# EAGLE schematic igreplane (EAGLE 5.06)
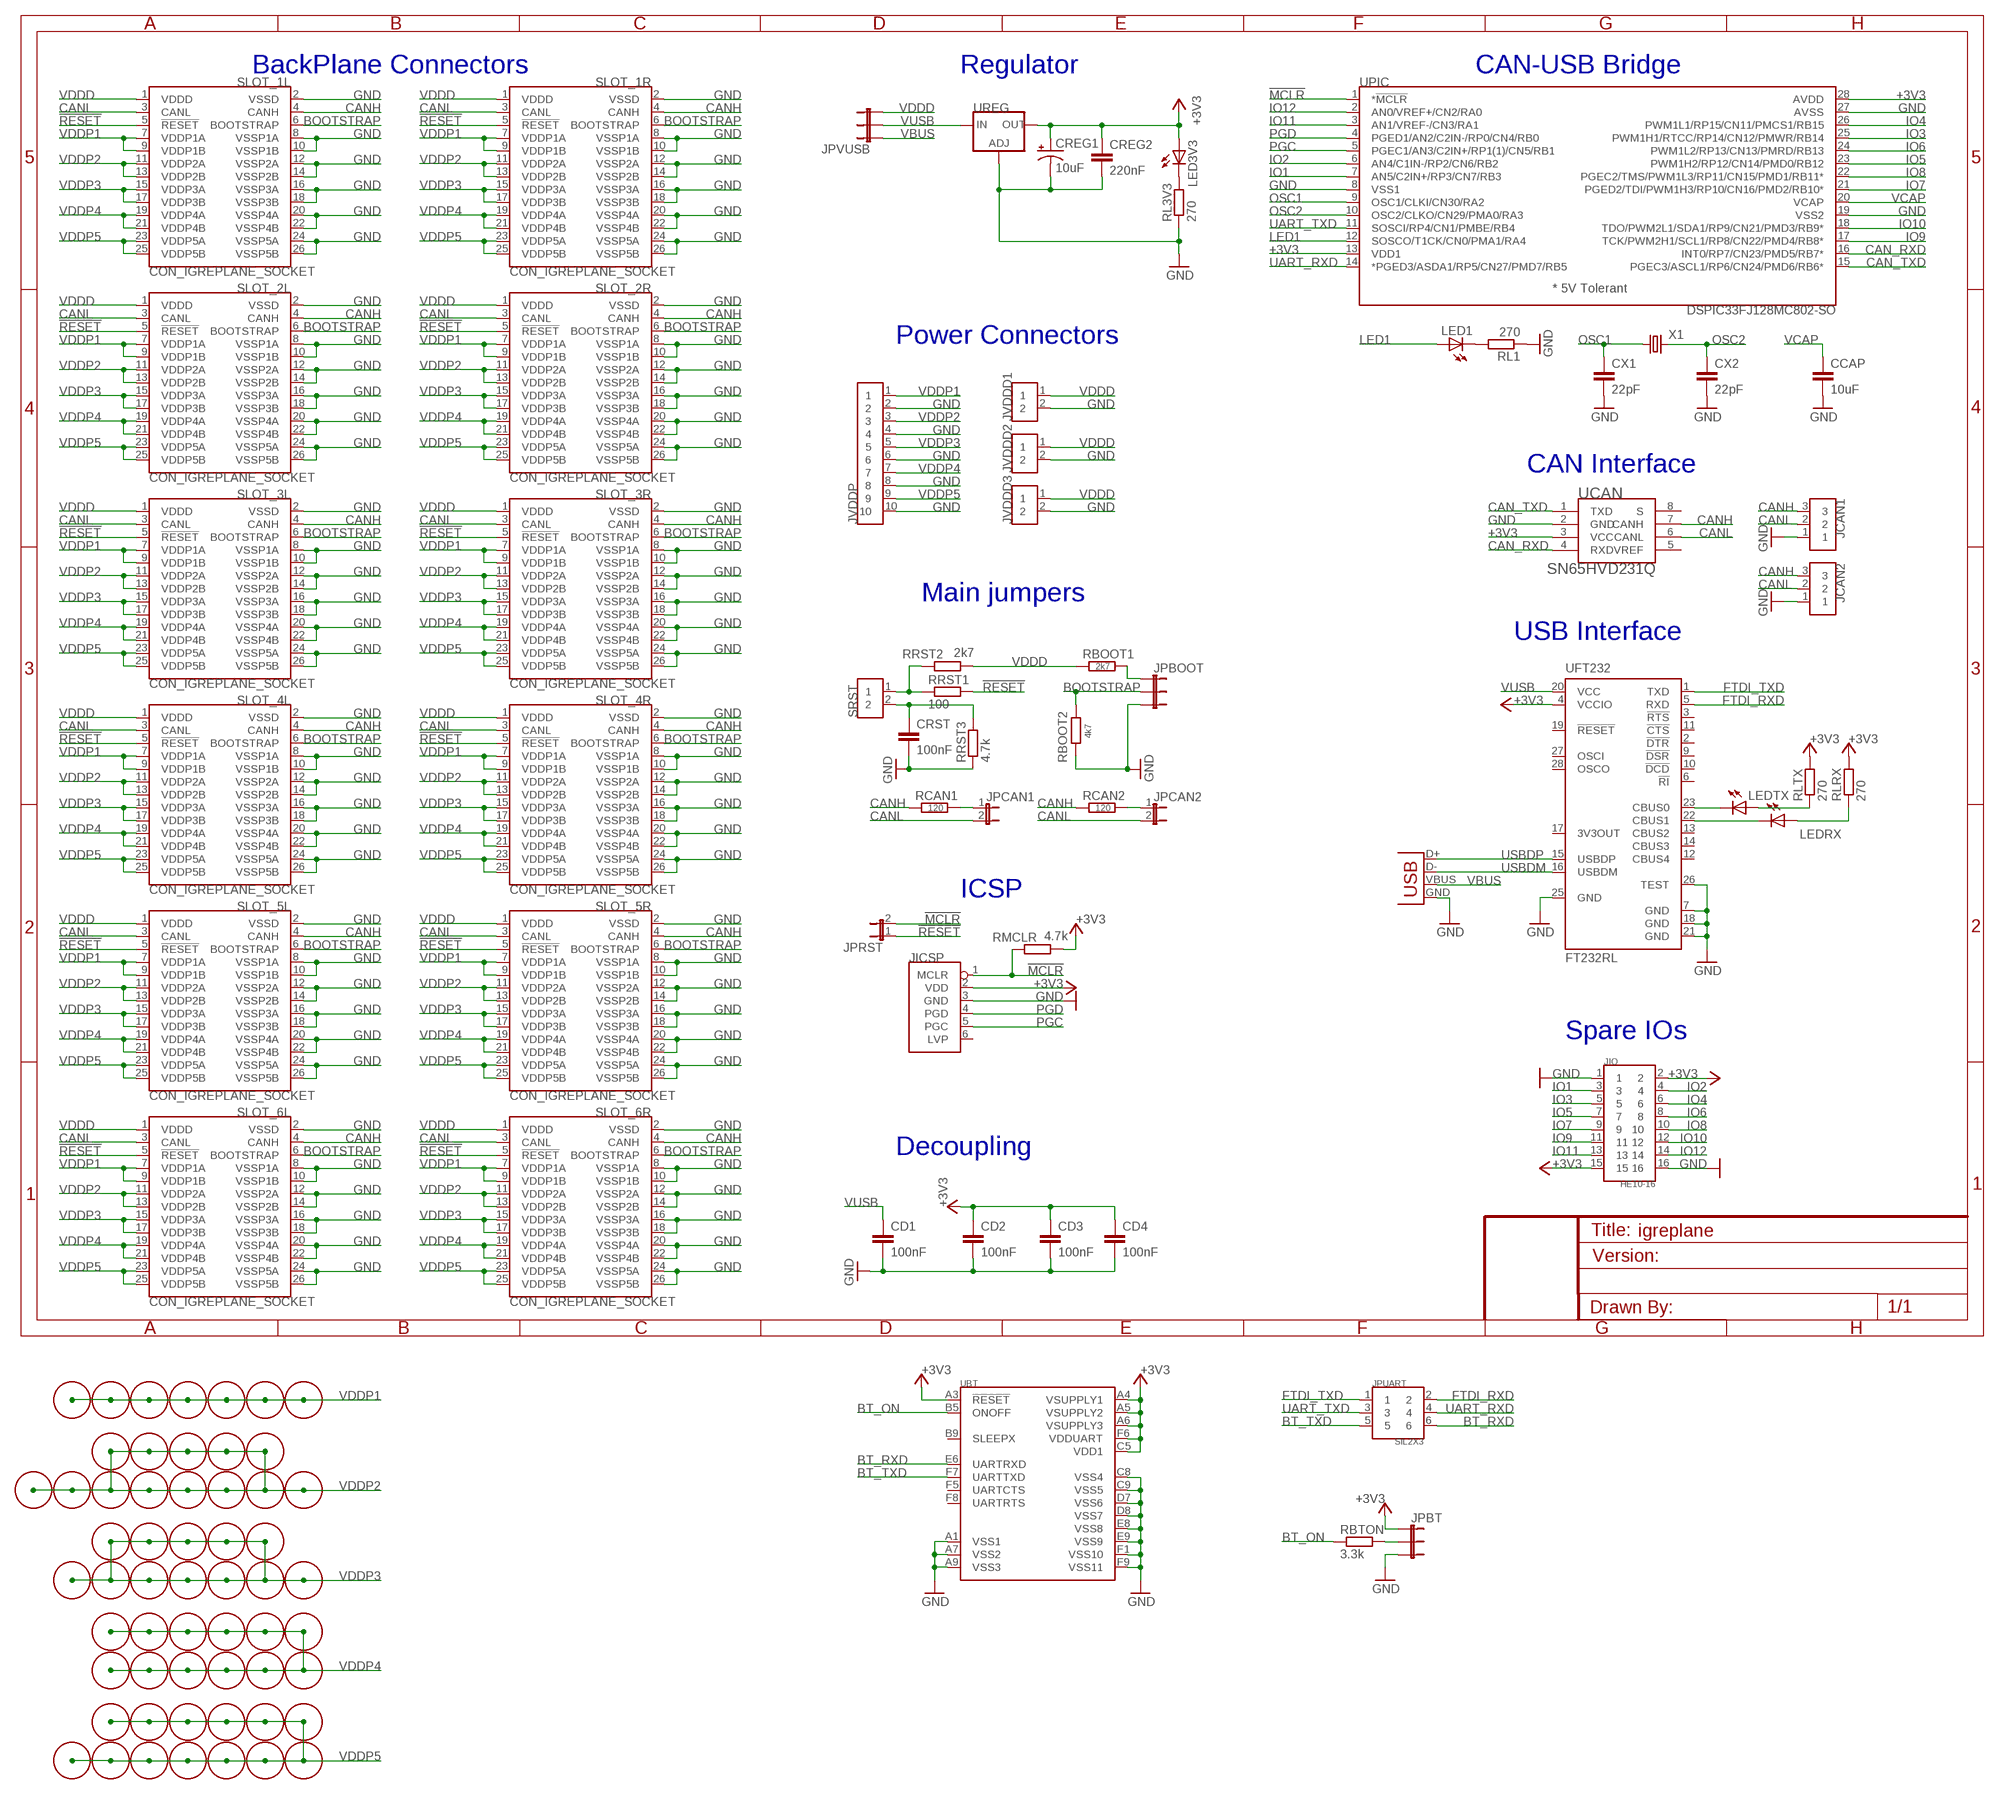
[diagram p0: schematic, sheet 1, part 1 of 2]
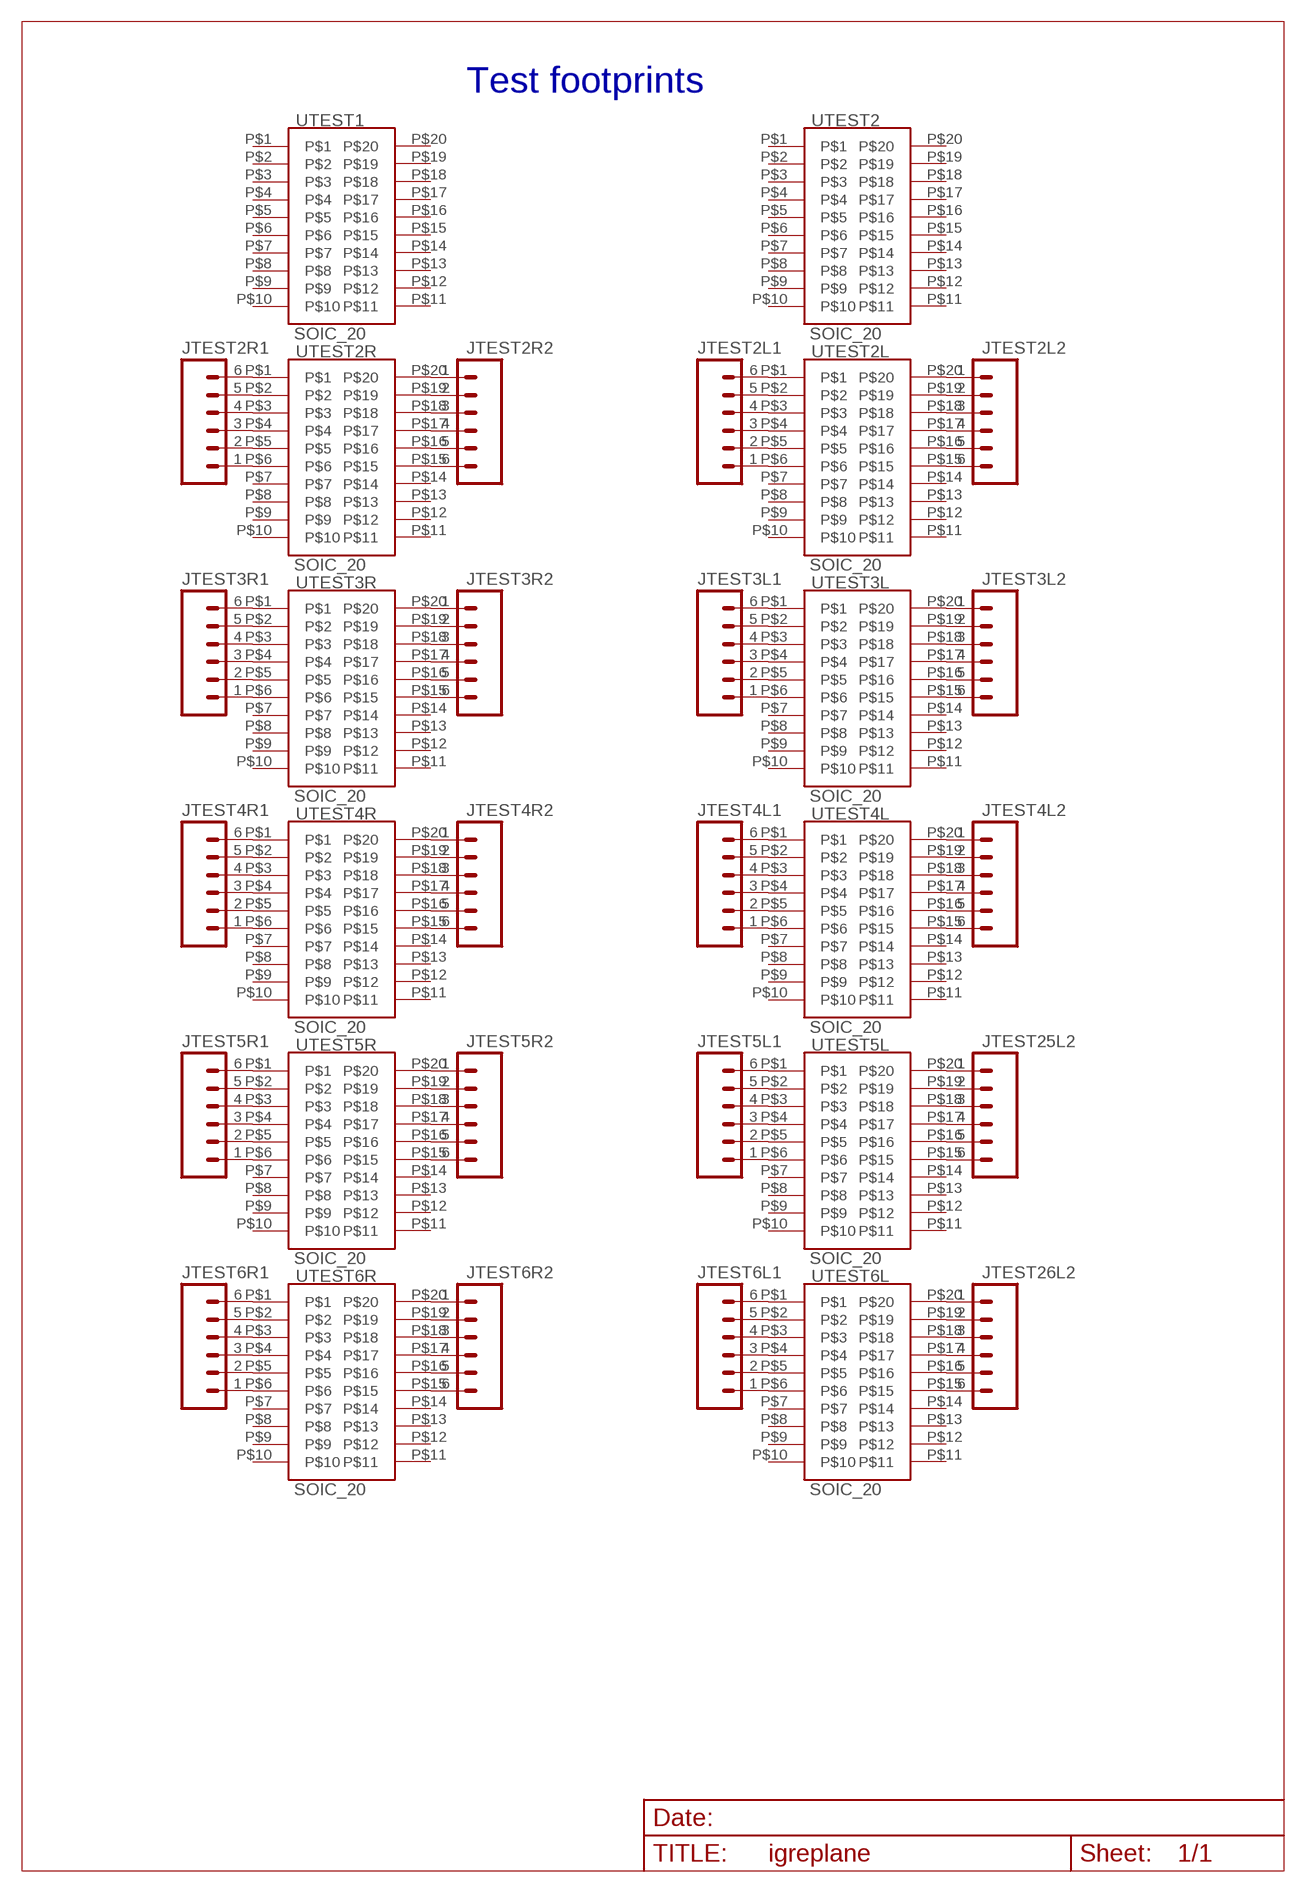
[diagram p1: schematic, sheet 1, part 2 of 2]

## Parts
CCAP  10uF  C-EUC1206  [C1206]
CD1  100nF  C-EUC0603  [C0603]
CD2  100nF  C-EUC0603  [C0603]
CD3  100nF  C-EUC0603  [C0603]
CD4  100nF  C-EUC0603  [C0603]
CREG1  10uF  CAP_POL1206  [EIA3216]
CREG2  220nF  C-EUC0603  [C0603]
CRST  100nF  C-EUC1206  [C1206]
CX1  22pF  C-EUC0603  [C0603]
CX2  22pF  C-EUC0603  [C0603]
JCAN1  SIL3  [CON3-2.54]
JCAN2  SIL3  [CON3-2.54]
JICSP  PICKIT_H  [PICKIT_H]
JIO  HE10-16  [CON-HE10-16-2.54]
JPBOOT  JUMPER-3PTH  [1X03]
JPBT  JUMPER-3PTH  [1X03]
JPCAN1  JUMPER-2PTH_LOCK  [1X02_LOCK]
JPCAN2  JUMPER-2PTH_LOCK  [1X02_LOCK]
JPRST  JUMPER-2PTH_LOCK  [1X02_LOCK]
JPUART  SIL2X3  [CON2X3-2.54]
JPVUSB  JUMPER-3PTH  [1X03]
JTEST2L1  M06SMD-STRAIGHT-ALT  [1X06_SMD_STRAIGHT_ALT]
JTEST2L2  M06SMD-STRAIGHT-ALT  [1X06_SMD_STRAIGHT_ALT]
JTEST2R1  M06SMD-STRAIGHT-ALT  [1X06_SMD_STRAIGHT_ALT]
JTEST2R2  M06SMD-STRAIGHT-ALT  [1X06_SMD_STRAIGHT_ALT]
JTEST3L1  M06SMD-STRAIGHT-ALT  [1X06_SMD_STRAIGHT_ALT]
JTEST3L2  M06SMD-STRAIGHT-ALT  [1X06_SMD_STRAIGHT_ALT]
JTEST3R1  M06SMD-STRAIGHT-ALT  [1X06_SMD_STRAIGHT_ALT]
JTEST3R2  M06SMD-STRAIGHT-ALT  [1X06_SMD_STRAIGHT_ALT]
JTEST4L1  M06SMD-STRAIGHT-ALT  [1X06_SMD_STRAIGHT_ALT]
JTEST4L2  M06SMD-STRAIGHT-ALT  [1X06_SMD_STRAIGHT_ALT]
JTEST4R1  M06SMD-STRAIGHT-ALT  [1X06_SMD_STRAIGHT_ALT]
JTEST4R2  M06SMD-STRAIGHT-ALT  [1X06_SMD_STRAIGHT_ALT]
JTEST5L1  M06SMD-STRAIGHT-ALT  [1X06_SMD_STRAIGHT_ALT]
JTEST5R1  M06SMD-STRAIGHT-ALT  [1X06_SMD_STRAIGHT_ALT]
JTEST5R2  M06SMD-STRAIGHT-ALT  [1X06_SMD_STRAIGHT_ALT]
JTEST6L1  M06SMD-STRAIGHT-ALT  [1X06_SMD_STRAIGHT_ALT]
JTEST6R1  M06SMD-STRAIGHT-ALT  [1X06_SMD_STRAIGHT_ALT]
JTEST6R2  M06SMD-STRAIGHT-ALT  [1X06_SMD_STRAIGHT_ALT]
JTEST25L2  M06SMD-STRAIGHT-ALT  [1X06_SMD_STRAIGHT_ALT]
JTEST26L2  M06SMD-STRAIGHT-ALT  [1X06_SMD_STRAIGHT_ALT]
JUSB  USBSMD  [USB-MINIB]
JVDDD1  SIL2  [CON2-2.54]
JVDDD2  SIL2  [CON2-2.54]
JVDDD3  SIL2  [CON2-2.54]
JVDDP  MULTICOMP_PA001-10  [CON10-5.00]
LED1  LEDCHIPLED_0603  [CHIPLED_0603]
LED3V3  LEDCHIPLED_0603  [CHIPLED_0603]
LEDRX  LEDCHIPLED_0603  [CHIPLED_0603]
LEDTX  LEDCHIPLED_0603  [CHIPLED_0603]
RBOOT1  2k7  R-EU_R0603  [R0603]
RBOOT2  4k7  R-EU_R0603  [R0603]
RBTON  3.3k  R-EU_R0603  [R0603]
RCAN1  120  R-EU_R0603  [R0603]
RCAN2  120  R-EU_R0603  [R0603]
RL1  270  R-EU_R0603  [R0603]
RL3V3  270  R-EU_R0603  [R0603]
RLRX  270  R-EU_R0603  [R0603]
RLTX  270  R-EU_R0603  [R0603]
RMCLR  4.7k  R-EU_R0603  [R0603]
RRST1  100  R-EU_R0603  [R0603]
RRST2  2k7  R-EU_R0603  [R0603]
RRST3  4.7k  R-EU_R0603  [R0603]
SLOT_1L  CON_IGREPLANE_SOCKET  [CON_WURTH_6130_26_216921]
SLOT_1R  CON_IGREPLANE_SOCKET  [CON_WURTH_6130_26_216921]
SLOT_2L  CON_IGREPLANE_SOCKET  [CON_WURTH_6130_26_216921]
SLOT_2R  CON_IGREPLANE_SOCKET  [CON_WURTH_6130_26_216921]
SLOT_3L  CON_IGREPLANE_SOCKET  [CON_WURTH_6130_26_216921]
SLOT_3R  CON_IGREPLANE_SOCKET  [CON_WURTH_6130_26_216921]
SLOT_4L  CON_IGREPLANE_SOCKET  [CON_WURTH_6130_26_216921]
SLOT_4R  CON_IGREPLANE_SOCKET  [CON_WURTH_6130_26_216921]
SLOT_5L  CON_IGREPLANE_SOCKET  [CON_WURTH_6130_26_216921]
SLOT_5R  CON_IGREPLANE_SOCKET  [CON_WURTH_6130_26_216921]
SLOT_6L  CON_IGREPLANE_SOCKET  [CON_WURTH_6130_26_216921]
SLOT_6R  CON_IGREPLANE_SOCKET  [CON_WURTH_6130_26_216921]
SRST  SIL2  [CON2-2.54]
U$1  VIA-5_0.3  [VIA-5_0.3]
U$2  VIA-5_0.3  [VIA-5_0.3]
U$3  VIA-5_0.3  [VIA-5_0.3]
U$4  VIA-5_0.3  [VIA-5_0.3]
U$5  VIA-5_0.3  [VIA-5_0.3]
U$6  VIA-5_0.3  [VIA-5_0.3]
U$7  VIA-5_0.3  [VIA-5_0.3]
U$8  VIA-5_0.3  [VIA-5_0.3]
U$9  VIA-5_0.3  [VIA-5_0.3]
U$10  VIA-5_0.3  [VIA-5_0.3]
U$11  VIA-5_0.3  [VIA-5_0.3]
U$12  VIA-5_0.3  [VIA-5_0.3]
U$13  VIA-5_0.3  [VIA-5_0.3]
U$14  VIA-5_0.3  [VIA-5_0.3]
U$15  VIA-5_0.3  [VIA-5_0.3]
U$16  VIA-5_0.3  [VIA-5_0.3]
U$17  VIA-5_0.3  [VIA-5_0.3]
U$18  VIA-5_0.3  [VIA-5_0.3]
U$19  VIA-5_0.3  [VIA-5_0.3]
U$20  VIA-5_0.3  [VIA-5_0.3]
U$21  VIA-5_0.3  [VIA-5_0.3]
U$22  VIA-5_0.3  [VIA-5_0.3]
U$23  VIA-5_0.3  [VIA-5_0.3]
U$24  VIA-5_0.3  [VIA-5_0.3]
U$25  VIA-5_0.3  [VIA-5_0.3]
U$26  VIA-5_0.3  [VIA-5_0.3]
U$27  VIA-5_0.3  [VIA-5_0.3]
U$28  VIA-5_0.3  [VIA-5_0.3]
U$29  VIA-5_0.3  [VIA-5_0.3]
U$30  VIA-5_0.3  [VIA-5_0.3]
U$31  VIA-5_0.3  [VIA-5_0.3]
U$32  VIA-5_0.3  [VIA-5_0.3]
U$33  VIA-5_0.3  [VIA-5_0.3]
U$34  VIA-5_0.3  [VIA-5_0.3]
U$35  VIA-5_0.3  [VIA-5_0.3]
U$37  VIA-5_0.3  [VIA-5_0.3]
U$38  VIA-5_0.3  [VIA-5_0.3]
U$39  VIA-5_0.3  [VIA-5_0.3]
U$40  VIA-5_0.3  [VIA-5_0.3]
U$41  VIA-5_0.3  [VIA-5_0.3]
U$42  VIA-5_0.3  [VIA-5_0.3]
U$43  VIA-5_0.3  [VIA-5_0.3]
U$44  VIA-5_0.3  [VIA-5_0.3]
U$45  VIA-5_0.3  [VIA-5_0.3]
U$46  VIA-5_0.3  [VIA-5_0.3]
U$47  VIA-5_0.3  [VIA-5_0.3]
U$48  VIA-5_0.3  [VIA-5_0.3]
U$49  VIA-5_0.3  [VIA-5_0.3]
U$50  VIA-5_0.3  [VIA-5_0.3]
U$51  VIA-5_0.3  [VIA-5_0.3]
U$52  VIA-5_0.3  [VIA-5_0.3]
U$53  VIA-5_0.3  [VIA-5_0.3]
U$54  VIA-5_0.3  [VIA-5_0.3]
U$55  VIA-5_0.3  [VIA-5_0.3]
U$56  VIA-5_0.3  [VIA-5_0.3]
U$57  VIA-5_0.3  [VIA-5_0.3]
U$58  VIA-5_0.3  [VIA-5_0.3]
UBT  PANASONIC_PAN1321-SPP  [BGA53_PAN1321-SSP]
UCAN  SN65HVD231Q  [SOIC8]
UFT232  FT232RL  [SSOP28]
UPIC  DSPIC33FJ128MC802-SO  [SOIC28]
UREG  V_REG_317SMD  [SOT223]
UTEST1  SOIC_20  [SO20W]
UTEST2  SOIC_20  [SO20W]
UTEST2L  SOIC_20  [SO20W]
UTEST2R  SOIC_20  [SO20W]
UTEST3L  SOIC_20  [SO20W]
UTEST3R  SOIC_20  [SO20W]
UTEST4L  SOIC_20  [SO20W]
UTEST4R  SOIC_20  [SO20W]
UTEST5L  SOIC_20  [SO20W]
UTEST5R  SOIC_20  [SO20W]
UTEST6L  SOIC_20  [SO20W]
UTEST6R  SOIC_20  [SO20W]
X1  CRYSTAL5X3  [CRYSTAL-SMD-5X3]

## Nets
!MCLR: JICSP.1(MCLR) JPRST.2 RMCLR.1 UPIC.1(*!MCLR!)
!RESET!: JPRST.1 RRST1.2 SLOT_1L.5(!RESET!) SLOT_1R.5(!RESET!) SLOT_2L.5(!RESET!) SLOT_2R.5(!RESET!) SLOT_3L.5(!RESET!) SLOT_3R.5(!RESET!) SLOT_4L.5(!RESET!) SLOT_4R.5(!RESET!) SLOT_5L.5(!RESET!) SLOT_5R.5(!RESET!) SLOT_6L.5(!RESET!) SLOT_6R.5(!RESET!)
+3V3 [POWER]: CD2.1 CD3.1 CD4.1 CREG1.A(+) CREG2.1 JICSP.2(VDD) JIO.2 JIO.15 JPBT.1 LED3V3.A RLRX.2 RLTX.2 RMCLR.2 UBT.A3(!RESET!) UBT.A4(VSUPPLY1) UBT.A5(VSUPPLY2) UBT.A6(VSUPPLY3) UBT.C5(VDD1) UBT.F6(VDDUART) UCAN.3(VCC) UFT232.4(VCCIO) UPIC.13(VDD1) UPIC.28(AVDD) UREG.2(OUT)
BOOTSTRAP: JPBOOT.2 RBOOT2.2 SLOT_1L.6(BOOTSTRAP) SLOT_1R.6(BOOTSTRAP) SLOT_2L.6(BOOTSTRAP) SLOT_2R.6(BOOTSTRAP) SLOT_3L.6(BOOTSTRAP) SLOT_3R.6(BOOTSTRAP) SLOT_4L.6(BOOTSTRAP) SLOT_4R.6(BOOTSTRAP) SLOT_5L.6(BOOTSTRAP) SLOT_5R.6(BOOTSTRAP) SLOT_6L.6(BOOTSTRAP) SLOT_6R.6(BOOTSTRAP)
BT_ON: RBTON.1 UBT.B5(ONOFF)
BT_RXD: JPUART.6 UBT.E6(UARTRXD)
BT_TXD: JPUART.5 UBT.F7(UARTTXD)
CAN_RXD: UCAN.4(RXD) UPIC.16(INT0/RP7/CN23/PMD5/RB7*)
CAN_TXD: UCAN.1(TXD) UPIC.15(PGEC3/ASCL1/RP6/CN24/PMD6/RB6*)
CANH: JCAN1.3 JCAN2.3 RCAN1.1 RCAN2.1 SLOT_1L.4(CANH) SLOT_1R.4(CANH) SLOT_2L.4(CANH) SLOT_2R.4(CANH) SLOT_3L.4(CANH) SLOT_3R.4(CANH) SLOT_4L.4(CANH) SLOT_4R.4(CANH) SLOT_5L.4(CANH) SLOT_5R.4(CANH) SLOT_6L.4(CANH) SLOT_6R.4(CANH) UCAN.7(CANH)
CANL: JCAN1.2 JCAN2.2 JPCAN1.2 JPCAN2.2 SLOT_1L.3(CANL) SLOT_1R.3(CANL) SLOT_2L.3(CANL) SLOT_2R.3(CANL) SLOT_3L.3(CANL) SLOT_3R.3(CANL) SLOT_4L.3(CANL) SLOT_4R.3(CANL) SLOT_5L.3(CANL) SLOT_5R.3(CANL) SLOT_6L.3(CANL) SLOT_6R.3(CANL) UCAN.6(CANL)
FTDI_RXD: JPUART.2 UFT232.5(RXD)
FTDI_TXD: JPUART.1 UFT232.1(TXD)
GND: CCAP.2 CD1.2 CD2.2 CD3.2 CD4.2 CREG1.C(-) CREG2.2 CRST.2 CX1.2 CX2.2 JCAN1.1 JCAN2.1 JICSP.3(GND) JIO.1 JIO.16 JPBOOT.3 JPBT.3 JUSB.GND JVDDD1.2 JVDDD2.2 JVDDD3.2 JVDDP.2 JVDDP.4 JVDDP.6 JVDDP.8 JVDDP.10 RBOOT2.1 RL1.1 RL3V3.1 RRST3.1 SLOT_1L.2(VSSD) SLOT_1L.8(VSSP1A) SLOT_1L.10(VSSP1B) SLOT_1L.12(VSSP2A) SLOT_1L.14(VSSP2B) SLOT_1L.16(VSSP3A) SLOT_1L.18(VSSP3B) SLOT_1L.20(VSSP4A) SLOT_1L.22(VSSP4B) SLOT_1L.24(VSSP5A) SLOT_1L.26(VSSP5B) SLOT_1R.2(VSSD) SLOT_1R.8(VSSP1A) SLOT_1R.10(VSSP1B) SLOT_1R.12(VSSP2A) SLOT_1R.14(VSSP2B) SLOT_1R.16(VSSP3A) SLOT_1R.18(VSSP3B) SLOT_1R.20(VSSP4A) SLOT_1R.22(VSSP4B) SLOT_1R.24(VSSP5A) SLOT_1R.26(VSSP5B) SLOT_2L.2(VSSD) SLOT_2L.8(VSSP1A) SLOT_2L.10(VSSP1B) SLOT_2L.12(VSSP2A) SLOT_2L.14(VSSP2B) SLOT_2L.16(VSSP3A) SLOT_2L.18(VSSP3B) SLOT_2L.20(VSSP4A) SLOT_2L.22(VSSP4B) SLOT_2L.24(VSSP5A) SLOT_2L.26(VSSP5B) SLOT_2R.2(VSSD) SLOT_2R.8(VSSP1A) SLOT_2R.10(VSSP1B) SLOT_2R.12(VSSP2A) SLOT_2R.14(VSSP2B) SLOT_2R.16(VSSP3A) SLOT_2R.18(VSSP3B) SLOT_2R.20(VSSP4A) SLOT_2R.22(VSSP4B) SLOT_2R.24(VSSP5A) SLOT_2R.26(VSSP5B) SLOT_3L.2(VSSD) SLOT_3L.8(VSSP1A) SLOT_3L.10(VSSP1B) SLOT_3L.12(VSSP2A) SLOT_3L.14(VSSP2B) SLOT_3L.16(VSSP3A) SLOT_3L.18(VSSP3B) SLOT_3L.20(VSSP4A) SLOT_3L.22(VSSP4B) SLOT_3L.24(VSSP5A) SLOT_3L.26(VSSP5B) SLOT_3R.2(VSSD) SLOT_3R.8(VSSP1A) SLOT_3R.10(VSSP1B) SLOT_3R.12(VSSP2A) SLOT_3R.14(VSSP2B) SLOT_3R.16(VSSP3A) SLOT_3R.18(VSSP3B) SLOT_3R.20(VSSP4A) SLOT_3R.22(VSSP4B) SLOT_3R.24(VSSP5A) SLOT_3R.26(VSSP5B) SLOT_4L.2(VSSD) SLOT_4L.8(VSSP1A) SLOT_4L.10(VSSP1B) SLOT_4L.12(VSSP2A) SLOT_4L.14(VSSP2B) SLOT_4L.16(VSSP3A) SLOT_4L.18(VSSP3B) SLOT_4L.20(VSSP4A) SLOT_4L.22(VSSP4B) SLOT_4L.24(VSSP5A) SLOT_4L.26(VSSP5B) SLOT_4R.2(VSSD) SLOT_4R.8(VSSP1A) SLOT_4R.10(VSSP1B) SLOT_4R.12(VSSP2A) SLOT_4R.14(VSSP2B) SLOT_4R.16(VSSP3A) SLOT_4R.18(VSSP3B) SLOT_4R.20(VSSP4A) SLOT_4R.22(VSSP4B) SLOT_4R.24(VSSP5A) SLOT_4R.26(VSSP5B) SLOT_5L.2(VSSD) SLOT_5L.8(VSSP1A) SLOT_5L.10(VSSP1B) SLOT_5L.12(VSSP2A) SLOT_5L.14(VSSP2B) SLOT_5L.16(VSSP3A) SLOT_5L.18(VSSP3B) SLOT_5L.20(VSSP4A) SLOT_5L.22(VSSP4B) SLOT_5L.24(VSSP5A) SLOT_5L.26(VSSP5B) SLOT_5R.2(VSSD) SLOT_5R.8(VSSP1A) SLOT_5R.10(VSSP1B) SLOT_5R.12(VSSP2A) SLOT_5R.14(VSSP2B) SLOT_5R.16(VSSP3A) SLOT_5R.18(VSSP3B) SLOT_5R.20(VSSP4A) SLOT_5R.22(VSSP4B) SLOT_5R.24(VSSP5A) SLOT_5R.26(VSSP5B) SLOT_6L.2(VSSD) SLOT_6L.8(VSSP1A) SLOT_6L.10(VSSP1B) SLOT_6L.12(VSSP2A) SLOT_6L.14(VSSP2B) SLOT_6L.16(VSSP3A) SLOT_6L.18(VSSP3B) SLOT_6L.20(VSSP4A) SLOT_6L.22(VSSP4B) SLOT_6L.24(VSSP5A) SLOT_6L.26(VSSP5B) SLOT_6R.2(VSSD) SLOT_6R.8(VSSP1A) SLOT_6R.10(VSSP1B) SLOT_6R.12(VSSP2A) SLOT_6R.14(VSSP2B) SLOT_6R.16(VSSP3A) SLOT_6R.18(VSSP3B) SLOT_6R.20(VSSP4A) SLOT_6R.22(VSSP4B) SLOT_6R.24(VSSP5A) SLOT_6R.26(VSSP5B) UBT.A1(VSS1) UBT.A7(VSS2) UBT.A9(VSS3) UBT.C8(VSS4) UBT.C9(VSS5) UBT.D7(VSS6) UBT.D8(VSS7) UBT.E8(VSS8) UBT.E9(VSS9) UBT.F1(VSS10) UBT.F9(VSS11) UCAN.2(GND) UFT232.7(GND) UFT232.18(GND) UFT232.21(GND) UFT232.25(GND) UFT232.26(TEST) UPIC.8(VSS1) UPIC.19(VSS2) UPIC.27(AVSS) UREG.1(ADJ)
IO1: JIO.3 UPIC.7(AN5/C2IN+/RP3/CN7/RB3)
IO2: JIO.4 UPIC.6(AN4/C1IN-/RP2/CN6/RB2)
IO3: JIO.5 UPIC.25(PWM1H1/RTCC/RP14/CN12/PMWR/RB14)
IO4: JIO.6 UPIC.26(PWM1L1/RP15/CN11/PMCS1/RB15)
IO5: JIO.7 UPIC.23(PWM1H2/RP12/CN14/PMD0/RB12)
IO6: JIO.8 UPIC.24(PWM1L2/RP13/CN13/PMRD/RB13)
IO7: JIO.9 UPIC.21(PGED2/TDI/PWM1H3/RP10/CN16/PMD2/RB10*)
IO8: JIO.10 UPIC.22(PGEC2/TMS/PWM1L3/RP11/CN15/PMD1/RB11*)
IO9: JIO.11 UPIC.17(TCK/PWM2H1/SCL1/RP8/CN22/PMD4/RB8*)
IO10: JIO.12 UPIC.18(TDO/PWM2L1/SDA1/RP9/CN21/PMD3/RB9*)
IO11: JIO.13 UPIC.3(AN1/VREF-/CN3/RA1)
IO12: JIO.14 UPIC.2(AN0/VREF+/CN2/RA0)
LED1: LED1.A UPIC.12(SOSCO/T1CK/CN0/PMA1/RA4)
N$1 [POWER]: JPCAN1.1 RCAN1.2
N$2: CRST.1 RRST3.2 SRST.2
N$3: RRST1.1 RRST2.1 SRST.1
N$4 [POWER]: JPCAN2.1 RCAN2.2
N$5: LEDTX.C UFT232.23(CBUS0)
N$6 [POWER]: JPBOOT.1 RBOOT1.1
N$7: LEDRX.C UFT232.22(CBUS1)
N$8: LEDTX.A RLTX.1
N$9: LEDRX.A RLRX.1
N$10: LED1.C RL1.2
N$11: LED3V3.C RL3V3.2
N$13: JPBT.2 RBTON.2
N$35: JTEST6R2.1 UTEST6R.P$20
N$52: JTEST6R2.2 UTEST6R.P$19
N$53: JTEST6R2.3 UTEST6R.P$18
N$54: JTEST6R2.4 UTEST6R.P$17
N$55: JTEST6R2.5 UTEST6R.P$16
N$56: JTEST6R2.6 UTEST6R.P$15
N$57: JTEST6R1.1 UTEST6R.P$6
N$58: JTEST6R1.2 UTEST6R.P$5
N$59: JTEST6R1.3 UTEST6R.P$4
N$60: JTEST6R1.4 UTEST6R.P$3
N$61: JTEST6R1.5 UTEST6R.P$2
N$62: JTEST6R1.6 UTEST6R.P$1
N$63: JTEST5R2.1 UTEST5R.P$20
N$64: JTEST5R2.2 UTEST5R.P$19
N$65: JTEST5R2.3 UTEST5R.P$18
N$66: JTEST5R2.4 UTEST5R.P$17
N$67: JTEST5R2.5 UTEST5R.P$16
N$68: JTEST5R2.6 UTEST5R.P$15
N$69: JTEST5R1.1 UTEST5R.P$6
N$70: JTEST5R1.2 UTEST5R.P$5
N$71: JTEST5R1.3 UTEST5R.P$4
N$72: JTEST5R1.4 UTEST5R.P$3
N$73: JTEST5R1.5 UTEST5R.P$2
N$74: JTEST5R1.6 UTEST5R.P$1
N$75: JTEST4R2.1 UTEST4R.P$20
N$76: JTEST4R2.2 UTEST4R.P$19
N$77: JTEST4R2.3 UTEST4R.P$18
N$78: JTEST4R2.4 UTEST4R.P$17
N$79: JTEST4R2.5 UTEST4R.P$16
N$80: JTEST4R2.6 UTEST4R.P$15
N$81: JTEST4R1.1 UTEST4R.P$6
N$82: JTEST4R1.2 UTEST4R.P$5
N$83: JTEST4R1.3 UTEST4R.P$4
N$84: JTEST4R1.4 UTEST4R.P$3
N$85: JTEST4R1.5 UTEST4R.P$2
N$86: JTEST4R1.6 UTEST4R.P$1
N$87: JTEST3R2.1 UTEST3R.P$20
N$88: JTEST3R2.2 UTEST3R.P$19
N$89: JTEST3R2.3 UTEST3R.P$18
N$90: JTEST3R2.4 UTEST3R.P$17
N$91: JTEST3R2.5 UTEST3R.P$16
N$92: JTEST3R2.6 UTEST3R.P$15
N$93: JTEST3R1.1 UTEST3R.P$6
N$94: JTEST3R1.2 UTEST3R.P$5
N$95: JTEST3R1.3 UTEST3R.P$4
N$96: JTEST3R1.4 UTEST3R.P$3
N$97: JTEST3R1.5 UTEST3R.P$2
N$98: JTEST3R1.6 UTEST3R.P$1
N$99: JTEST2R2.1 UTEST2R.P$20
N$100: JTEST2R2.2 UTEST2R.P$19
N$101: JTEST2R2.3 UTEST2R.P$18
N$102: JTEST2R2.4 UTEST2R.P$17
N$103: JTEST2R2.5 UTEST2R.P$16
N$104: JTEST2R2.6 UTEST2R.P$15
N$105: JTEST2R1.1 UTEST2R.P$6
N$106: JTEST2R1.2 UTEST2R.P$5
N$107: JTEST2R1.3 UTEST2R.P$4
N$108: JTEST2R1.4 UTEST2R.P$3
N$109: JTEST2R1.5 UTEST2R.P$2
N$110: JTEST2R1.6 UTEST2R.P$1
N$111: JTEST2L1.1 UTEST2L.P$6
N$112: JTEST2L1.2 UTEST2L.P$5
N$113: JTEST2L1.3 UTEST2L.P$4
N$114: JTEST2L1.4 UTEST2L.P$3
N$115: JTEST2L1.5 UTEST2L.P$2
N$116: JTEST2L1.6 UTEST2L.P$1
N$117: JTEST3L1.1 UTEST3L.P$6
N$118: JTEST3L1.2 UTEST3L.P$5
N$119: JTEST3L1.3 UTEST3L.P$4
N$120: JTEST3L1.4 UTEST3L.P$3
N$121: JTEST3L1.5 UTEST3L.P$2
N$122: JTEST3L1.6 UTEST3L.P$1
N$123: JTEST4L1.1 UTEST4L.P$6
N$124: JTEST4L1.2 UTEST4L.P$5
N$125: JTEST4L1.3 UTEST4L.P$4
N$126: JTEST4L1.4 UTEST4L.P$3
N$127: JTEST4L1.5 UTEST4L.P$2
N$128: JTEST4L1.6 UTEST4L.P$1
N$129: JTEST5L1.1 UTEST5L.P$6
N$130: JTEST5L1.2 UTEST5L.P$5
N$131: JTEST5L1.3 UTEST5L.P$4
N$132: JTEST5L1.4 UTEST5L.P$3
N$133: JTEST5L1.5 UTEST5L.P$2
N$134: JTEST5L1.6 UTEST5L.P$1
N$135: JTEST6L1.1 UTEST6L.P$6
N$136: JTEST6L1.2 UTEST6L.P$5
N$137: JTEST6L1.3 UTEST6L.P$4
N$138: JTEST6L1.4 UTEST6L.P$3
N$139: JTEST6L1.5 UTEST6L.P$2
N$140: JTEST6L1.6 UTEST6L.P$1
N$141: JTEST2L2.1 UTEST2L.P$20
N$142: JTEST2L2.2 UTEST2L.P$19
N$143: JTEST2L2.3 UTEST2L.P$18
N$144: JTEST2L2.4 UTEST2L.P$17
N$145: JTEST2L2.5 UTEST2L.P$16
N$146: JTEST2L2.6 UTEST2L.P$15
N$147: JTEST3L2.1 UTEST3L.P$20
N$148: JTEST3L2.2 UTEST3L.P$19
N$149: JTEST3L2.3 UTEST3L.P$18
N$150: JTEST3L2.4 UTEST3L.P$17
N$151: JTEST3L2.5 UTEST3L.P$16
N$152: JTEST3L2.6 UTEST3L.P$15
N$153: JTEST4L2.1 UTEST4L.P$20
N$154: JTEST4L2.2 UTEST4L.P$19
N$155: JTEST4L2.3 UTEST4L.P$18
N$156: JTEST4L2.4 UTEST4L.P$17
N$157: JTEST4L2.5 UTEST4L.P$16
N$158: JTEST4L2.6 UTEST4L.P$15
N$159: JTEST25L2.1 UTEST5L.P$20
N$160: JTEST25L2.2 UTEST5L.P$19
N$161: JTEST25L2.3 UTEST5L.P$18
N$162: JTEST25L2.4 UTEST5L.P$17
N$163: JTEST25L2.5 UTEST5L.P$16
N$164: JTEST25L2.6 UTEST5L.P$15
N$165: JTEST26L2.1 UTEST6L.P$20
N$166: JTEST26L2.2 UTEST6L.P$19
N$167: JTEST26L2.3 UTEST6L.P$18
N$168: JTEST26L2.4 UTEST6L.P$17
N$169: JTEST26L2.5 UTEST6L.P$16
N$170: JTEST26L2.6 UTEST6L.P$15
OSC1: CX1.1 UPIC.9(OSC1/CLKI/CN30/RA2) X1.1
OSC2: CX2.1 UPIC.10(OSC2/CLKO/CN29/PMA0/RA3) X1.3
PGC: JICSP.5(PGC) UPIC.5(PGEC1/AN3/C2IN+/RP1(1)/CN5/RB1)
PGD: JICSP.4(PGD) UPIC.4(PGED1/AN2/C2IN-/RP0/CN4/RB0)
UART_RXD: JPUART.4 UPIC.14(*PGED3/ASDA1/RP5/CN27/PMD7/RB5)
UART_TXD: JPUART.3 UPIC.11(SOSCI/RP4/CN1/PMBE/RB4)
USBDM: JUSB.D- UFT232.16(USBDM)
USBDP: JUSB.D+ UFT232.15(USBDP)
VBUS: JPVUSB.1 JUSB.VBUS
VCAP: CCAP.1 UPIC.20(VCAP)
VDDD: JPVUSB.3 JVDDD1.1 JVDDD2.1 JVDDD3.1 RBOOT1.2 RRST2.2 SLOT_1L.1(VDDD) SLOT_1R.1(VDDD) SLOT_2L.1(VDDD) SLOT_2R.1(VDDD) SLOT_3L.1(VDDD) SLOT_3R.1(VDDD) SLOT_4L.1(VDDD) SLOT_4R.1(VDDD) SLOT_5L.1(VDDD) SLOT_5R.1(VDDD) SLOT_6L.1(VDDD) SLOT_6R.1(VDDD)
VDDP1 [POWER]: JVDDP.1 SLOT_1L.7(VDDP1A) SLOT_1L.9(VDDP1B) SLOT_1R.7(VDDP1A) SLOT_1R.9(VDDP1B) SLOT_2L.7(VDDP1A) SLOT_2L.9(VDDP1B) SLOT_2R.7(VDDP1A) SLOT_2R.9(VDDP1B) SLOT_3L.7(VDDP1A) SLOT_3L.9(VDDP1B) SLOT_3R.7(VDDP1A) SLOT_3R.9(VDDP1B) SLOT_4L.7(VDDP1A) SLOT_4L.9(VDDP1B) SLOT_4R.7(VDDP1A) SLOT_4R.9(VDDP1B) SLOT_5L.7(VDDP1A) SLOT_5L.9(VDDP1B) SLOT_5R.7(VDDP1A) SLOT_5R.9(VDDP1B) SLOT_6L.7(VDDP1A) SLOT_6L.9(VDDP1B) SLOT_6R.7(VDDP1A) SLOT_6R.9(VDDP1B) U$25.VIA U$26.VIA U$27.VIA U$28.VIA U$29.VIA U$30.VIA U$57.VIA
VDDP2 [POWER]: JVDDP.3 SLOT_1L.11(VDDP2A) SLOT_1L.13(VDDP2B) SLOT_1R.11(VDDP2A) SLOT_1R.13(VDDP2B) SLOT_2L.11(VDDP2A) SLOT_2L.13(VDDP2B) SLOT_2R.11(VDDP2A) SLOT_2R.13(VDDP2B) SLOT_3L.11(VDDP2A) SLOT_3L.13(VDDP2B) SLOT_3R.11(VDDP2A) SLOT_3R.13(VDDP2B) SLOT_4L.11(VDDP2A) SLOT_4L.13(VDDP2B) SLOT_4R.11(VDDP2A) SLOT_4R.13(VDDP2B) SLOT_5L.11(VDDP2A) SLOT_5L.13(VDDP2B) SLOT_5R.11(VDDP2A) SLOT_5R.13(VDDP2B) SLOT_6L.11(VDDP2A) SLOT_6L.13(VDDP2B) SLOT_6R.11(VDDP2A) SLOT_6R.13(VDDP2B) U$31.VIA U$32.VIA U$33.VIA U$34.VIA U$35.VIA U$37.VIA U$38.VIA U$39.VIA U$40.VIA U$41.VIA U$42.VIA U$43.VIA U$56.VIA
VDDP3 [POWER]: JVDDP.5 SLOT_1L.15(VDDP3A) SLOT_1L.17(VDDP3B) SLOT_1R.15(VDDP3A) SLOT_1R.17(VDDP3B) SLOT_2L.15(VDDP3A) SLOT_2L.17(VDDP3B) SLOT_2R.15(VDDP3A) SLOT_2R.17(VDDP3B) SLOT_3L.15(VDDP3A) SLOT_3L.17(VDDP3B) SLOT_3R.15(VDDP3A) SLOT_3R.17(VDDP3B) SLOT_4L.15(VDDP3A) SLOT_4L.17(VDDP3B) SLOT_4R.15(VDDP3A) SLOT_4R.17(VDDP3B) SLOT_5L.15(VDDP3A) SLOT_5L.17(VDDP3B) SLOT_5R.15(VDDP3A) SLOT_5R.17(VDDP3B) SLOT_6L.15(VDDP3A) SLOT_6L.17(VDDP3B) SLOT_6R.15(VDDP3A) SLOT_6R.17(VDDP3B) U$44.VIA U$45.VIA U$46.VIA U$47.VIA U$48.VIA U$49.VIA U$50.VIA U$51.VIA U$52.VIA U$53.VIA U$54.VIA U$55.VIA
VDDP4 [POWER]: JVDDP.7 SLOT_1L.19(VDDP4A) SLOT_1L.21(VDDP4B) SLOT_1R.19(VDDP4A) SLOT_1R.21(VDDP4B) SLOT_2L.19(VDDP4A) SLOT_2L.21(VDDP4B) SLOT_2R.19(VDDP4A) SLOT_2R.21(VDDP4B) SLOT_3L.19(VDDP4A) SLOT_3L.21(VDDP4B) SLOT_3R.19(VDDP4A) SLOT_3R.21(VDDP4B) SLOT_4L.19(VDDP4A) SLOT_4L.21(VDDP4B) SLOT_4R.19(VDDP4A) SLOT_4R.21(VDDP4B) SLOT_5L.19(VDDP4A) SLOT_5L.21(VDDP4B) SLOT_5R.19(VDDP4A) SLOT_5R.21(VDDP4B) SLOT_6L.19(VDDP4A) SLOT_6L.21(VDDP4B) SLOT_6R.19(VDDP4A) SLOT_6R.21(VDDP4B) U$1.VIA U$2.VIA U$3.VIA U$4.VIA U$5.VIA U$6.VIA U$7.VIA U$8.VIA U$9.VIA U$10.VIA U$11.VIA U$12.VIA
VDDP5 [POWER]: JVDDP.9 SLOT_1L.23(VDDP5A) SLOT_1L.25(VDDP5B) SLOT_1R.23(VDDP5A) SLOT_1R.25(VDDP5B) SLOT_2L.23(VDDP5A) SLOT_2L.25(VDDP5B) SLOT_2R.23(VDDP5A) SLOT_2R.25(VDDP5B) SLOT_3L.23(VDDP5A) SLOT_3L.25(VDDP5B) SLOT_3R.23(VDDP5A) SLOT_3R.25(VDDP5B) SLOT_4L.23(VDDP5A) SLOT_4L.25(VDDP5B) SLOT_4R.23(VDDP5A) SLOT_4R.25(VDDP5B) SLOT_5L.23(VDDP5A) SLOT_5L.25(VDDP5B) SLOT_5R.23(VDDP5A) SLOT_5R.25(VDDP5B) SLOT_6L.23(VDDP5A) SLOT_6L.25(VDDP5B) SLOT_6R.23(VDDP5A) SLOT_6R.25(VDDP5B) U$13.VIA U$14.VIA U$15.VIA U$16.VIA U$17.VIA U$18.VIA U$19.VIA U$20.VIA U$21.VIA U$22.VIA U$23.VIA U$24.VIA U$58.VIA
VUSB: CD1.1 JPVUSB.2 UFT232.20(VCC) UREG.3(IN)
Unconnected: JICSP.6(LVP) UBT.B9(SLEEPX) UBT.F5(UARTCTS) UBT.F8(UARTRTS) UCAN.5(VREF) UCAN.8(S) UFT232.2(!DTR) UFT232.3(!RTS) UFT232.6(!RI) UFT232.9(!DSR) UFT232.10(!DCD) UFT232.11(!CTS) UFT232.12(CBUS4) UFT232.13(CBUS2) UFT232.14(CBUS3) UFT232.17(3V3OUT) UFT232.19(!RESET) UFT232.27(OSCI) UFT232.28(OSCO) UTEST1.P$1 UTEST1.P$2 UTEST1.P$3 UTEST1.P$4 UTEST1.P$5 UTEST1.P$6 UTEST1.P$7 UTEST1.P$8 UTEST1.P$9 UTEST1.P$10 UTEST1.P$11 UTEST1.P$12 UTEST1.P$13 UTEST1.P$14 UTEST1.P$15 UTEST1.P$16 UTEST1.P$17 UTEST1.P$18 UTEST1.P$19 UTEST1.P$20 UTEST2.P$1 UTEST2.P$2 UTEST2.P$3 UTEST2.P$4 UTEST2.P$5 UTEST2.P$6 UTEST2.P$7 UTEST2.P$8 UTEST2.P$9 UTEST2.P$10 UTEST2.P$11 UTEST2.P$12 UTEST2.P$13 UTEST2.P$14 UTEST2.P$15 UTEST2.P$16 UTEST2.P$17 UTEST2.P$18 UTEST2.P$19 UTEST2.P$20 UTEST2L.P$7 UTEST2L.P$8 UTEST2L.P$9 UTEST2L.P$10 UTEST2L.P$11 UTEST2L.P$12 UTEST2L.P$13 UTEST2L.P$14 UTEST2R.P$7 UTEST2R.P$8 UTEST2R.P$9 UTEST2R.P$10 UTEST2R.P$11 UTEST2R.P$12 UTEST2R.P$13 UTEST2R.P$14 UTEST3L.P$7 UTEST3L.P$8 UTEST3L.P$9 UTEST3L.P$10 UTEST3L.P$11 UTEST3L.P$12 UTEST3L.P$13 UTEST3L.P$14 UTEST3R.P$7 UTEST3R.P$8 UTEST3R.P$9 UTEST3R.P$10 UTEST3R.P$11 UTEST3R.P$12 UTEST3R.P$13 UTEST3R.P$14 UTEST4L.P$7 UTEST4L.P$8 UTEST4L.P$9 UTEST4L.P$10 UTEST4L.P$11 UTEST4L.P$12 UTEST4L.P$13 UTEST4L.P$14 UTEST4R.P$7 UTEST4R.P$8 UTEST4R.P$9 UTEST4R.P$10 UTEST4R.P$11 UTEST4R.P$12 UTEST4R.P$13 UTEST4R.P$14 UTEST5L.P$7 UTEST5L.P$8 UTEST5L.P$9 UTEST5L.P$10 UTEST5L.P$11 UTEST5L.P$12 UTEST5L.P$13 UTEST5L.P$14 UTEST5R.P$7 UTEST5R.P$8 UTEST5R.P$9 UTEST5R.P$10 UTEST5R.P$11 UTEST5R.P$12 UTEST5R.P$13 UTEST5R.P$14 UTEST6L.P$7 UTEST6L.P$8 UTEST6L.P$9 UTEST6L.P$10 UTEST6L.P$11 UTEST6L.P$12 UTEST6L.P$13 UTEST6L.P$14 UTEST6R.P$7 UTEST6R.P$8 UTEST6R.P$9 UTEST6R.P$10 UTEST6R.P$11 UTEST6R.P$12 UTEST6R.P$13 UTEST6R.P$14

## Notes on the sheet
- Test footprints
- BackPlane Connectors | Regulator | CAN-USB Bridge
- Power Connectors
- CAN Interface
- Main jumpers
- USB Interface
- ICSP
- Spare IOs
- Decoupling

## Library data of the parts
CCAP CRST = resistor:C-EU: CAPACITOR, European symbol
CD1-CD4 CREG2 CX1 CX2 = rcl:C-EU: CAPACITOR, European symbol
CREG1 = SparkFun:CAP_POL: Capacitor Polarized These are standard SMD and PTH capacitors. Normally 10uF, 47uF, and 100uF in electrolytic and tantalum varieties. Always verify the external diameter of the through hole cap, it varies with capacity, voltage, and manufacturer. The EIA devices should be standard.
JCAN1 JCAN2 = lib_paul:SIL3
JICSP = lib_paul:PICKIT_H
JIO = lib_paul:HE10-16
JPBOOT JPBT JPVUSB = SparkFun:JUMPER-3
JPCAN1 JPCAN2 JPRST = SparkFun:JUMPER-2: Jumper Basic 0.1" spaced jumper. Use with breakaway headers.
JPUART = lib_paul:SIL2X3
JTEST2L1 JTEST2L2 JTEST2R1 JTEST2R2 JTEST3L1 JTEST3L2 JTEST3R1 JTEST3R2 JTEST4L1 JTEST4L2 JTEST4R1 JTEST4R2 JTEST5L1 JTEST5R1 JTEST5R2 JTEST6L1 JTEST6R1 JTEST6R2 JTEST25L2 JTEST26L2 = SparkFun:M06: Header 6 Standard 6-pin 0.1" header. Use with straight break away headers (SKU : PRT-00116), right angle break away headers (PRT-00553), swiss pins (PRT-00743), machine pins (PRT-00117), and female headers (PRT-00115). Molex polarized connector foot print use with SKU : PRT-08094 with associated crimp pins and housings. NOTES ON THE VARIANTS LOCK and LOCK_LONGPADS... This footprint was designed to help hold the alignment of a through-hole component (i.e. 6-pin header) while soldering it into place. You may notice that each hole has been shifted either up or down by 0.005 of an inch from it's more standard position (which is a perfectly straight line). This slight alteration caused the pins (the squares in the middle) to touch the edges of the holes. Because they are alternating, it causes a "brace" to hold the component in place. 0.005 has proven to be the perfect amount of "off-center" position when using our standard breakaway headers. Although looks a little odd when you look at the bare footprint, once you have a header in there, the alteration is very hard to notice. Also, if you push a header all the way into place, it is covered up entirely on the bottom side. This idea of altering the position of holes to aid alignment will be further integrated into the Sparkfun Library for other footprints. It can help hold any component with 3 or more connection pins.
JUSB = SparkFun:USB: USB Connectors USB-B-PTH is fully proven SKU : PRT-00139 USB-miniB is fully proven SKU : PRT-00587 USB-A-PCB is untested. USB-A-H is throughly reviewed, but untested. Spark Fun Electronics SKU : PRT-00437 USB-B-SMT is throughly reviewed, but untested. Needs silkscreen touching up. USB-A-S has not been used/tested USB-MB-H has not been used/tested
JVDDD1-JVDDD3 SRST = lib_paul:SIL2
JVDDP = lib_paul:MULTICOMP_PA001-10
LED1 LED3V3 LEDRX LEDTX = led:LED: LED OSRAM: - CHIPLED LG R971, LG N971, LY N971, LG Q971, LY Q971, LO R971, LY R971 LH N974, LH R974 LS Q976, LO Q976, LY Q976 LO Q996 - Hyper CHIPLED LW Q18S LB Q993, LB Q99A, LB R99A - SideLED LS A670, LO A670, LY A670, LG A670, LP A670 LB A673, LV A673, LT A673, LW A673 LH A674 LY A675 LS A676, LA A676, LO A676, LY A676, LW A676 LS A679, LY A679, LG A679 - Hyper Micro SIDELED® LS Y876, LA Y876, LO Y876, LY Y876 LT Y87S - SmartLED LW L88C, LW L88S LB L89C, LB L89S, LG L890 LS L89K, LO L89K, LY L89K LS L896, LA L896, LO L896, LY L896 - TOPLED LS T670, LO T670, LY T670, LG T670, LP T670 LSG T670, LSP T670, LSY T670, LOP T670, LYG T670 LG T671, LOG T671, LSG T671 LB T673, LV T673, LT T673, LW T673 LH T674 LS T676, LA T676, LO T676, LY T676, LB T676, LH T676, LSB T676, LW T676 LB T67C, LV T67C, LT T67C, LS T67K, LO T67K, LY T67K, LW E67C LS E67B, LA E67B, LO E67B, LY E67B, LB E67C, LV E67C, LT E67C LW T67C LS T679, LY T679, LG T679 LS T770, LO T770, LY T770, LG T770, LP T770 LB T773, LV T773, LT T773, LW T773 LH T774 LS E675, LA E675, LY E675, LS T675 LS T776, LA T776, LO T776, LY T776, LB T776 LHGB T686 LT T68C, LB T68C - Hyper Mini TOPLED® LB M676 - Mini TOPLED Santana® LG M470 LS M47K, LO M47K, LY M47K Source: http://www.osram.convergy.de LUXEON: - LUMILED® LXK2-PW12-R00, LXK2-PW12-S00, LXK2-PW14-U00, LXK2-PW14-V00 LXK2-PM12-R00, LXK2-PM12-S00, LXK2-PM14-U00 LXK2-PE12-Q00, LXK2-PE12-R00, LXK2-PE12-S00, LXK2-PE14-T00, LXK2-PE14-U00 LXK2-PB12-K00, LXK2-PB12-L00, LXK2-PB12-M00, LXK2-PB14-N00, LXK2-PB14-P00, LXK2-PB14-Q00 LXK2-PR12-L00, LXK2-PR12-M00, LXK2-PR14-Q00, LXK2-PR14-R00 LXK2-PD12-Q00, LXK2-PD12-R00, LXK2-PD12-S00 LXK2-PH12-R00, LXK2-PH12-S00 LXK2-PL12-P00, LXK2-PL12-Q00, LXK2-PL12-R00 Source: www.luxeon.com KINGBRIGHT: KA-3528ASYC Source: www.kingbright.com
RBOOT1 RBOOT2 RBTON RCAN1 RCAN2 RL1 RL3V3 RLRX RLTX RMCLR RRST1-RRST3 = rcl:R-EU_: RESISTOR, European symbol
SLOT_1L SLOT_1R SLOT_2L SLOT_2R SLOT_3L SLOT_3R SLOT_4L SLOT_4R SLOT_5L SLOT_5R SLOT_6L SLOT_6R = igreplane:CON_IGREPLANE_SOCKET
U$1-U$35 U$37-U$58 = igreplane:VIA-5_0.3
UBT = igreplane:PANASONIC_PAN1321-SPP
UCAN = lib_paul:SN65HVD231Q
UFT232 = ftdichip:FT232R: Source: http://www.ftdichip.com/Documents/DataSheets/DS_FT232R_v104.pdf
UPIC = lib_paul:DSPIC33FJ128MC802-SO
UREG = SparkFun:V_REG_317: Voltage Regulator Standard LM317 adjustable voltage regulator. AOI (Adjust Output Input). Google 'LM317 Calculator' for easy to use app to get the two resistor values needed. 240/720 for 5V output. 240/390 for 3.3V output. Spark Fun Electronics SKU : COM-00527
UTEST1 UTEST2 UTEST2L UTEST2R UTEST3L UTEST3R UTEST4L UTEST4R UTEST5L UTEST5R UTEST6L UTEST6R = SparkFun:SOIC_20
X1 = SparkFun:CRYSTAL: Crystals Various standard crystals. Proven footprints. Spark Fun Electronics SKU : COM-00534

## Net classes
0 default: drill 0.3 mm, clearance 0.152 mm
1 POWER: drill 0.3 mm, clearance 0.152 mm